# Altium project Monitor.PrjPCB
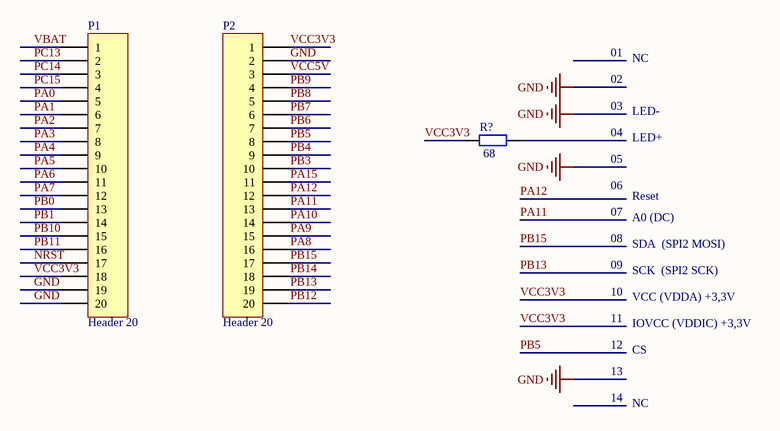
[diagram p0: Monitor_1.SchDoc]
1 sheet, 3 parts. Net scope: global (net labels, ports and power ports of the same name join across sheets).

## Sheet Monitor_1.SchDoc: Debug Monitor
size A4; Author: Vitaly Lev; DrawnBy: Vitaly Lev; Organization: Vitaly Lev; Address1: vitaly.lev@gmail.com; DocumentNumber: 1; Revision: 1.0; SheetNumber: 1; SheetTotal: 2

### Parts
P1  Header 20  [HDR1X20]
P2  Header 20  [HDR1X20]
R?  value 68  [AXIAL-0.4]  (hidden comment: Res2)

### Nets
GND: P1.19 P1.20 P2.2
NRST: P1.17
PA0: P1.5
PA1: P1.6
PA2: P1.7
PA3: P1.8
PA4: P1.9
PA5: P1.10
PA6: P1.11
PA7: P1.12
PA8: P2.16
PA9: P2.15
PA10: P2.14
PA11: P2.13
PA12: P2.12
PA15: P2.11
PB0: P1.13
PB1: P1.14
PB3: P2.10
PB4: P2.9
PB5: P2.8
PB6: P2.7
PB7: P2.6
PB8: P2.5
PB9: P2.4
PB10: P1.15
PB11: P1.16
PB12: P2.20
PB13: P2.19
PB14: P2.18
PB15: P2.17
PC13: P1.2
PC14: P1.3
PC15: P1.4
VBAT: P1.1
VCC3V3: P1.18 P2.1 R?.1
VCC5V: P2.3

Not connected (* = marked no-connect by the designer): R? 2

### Notes on the sheet
- 01
- NC
- 02
- 03
- LED-
- 04
- 05
- 06
- LED+
- 07
- 08
- Reset
- A0 (DC)
- SDA  (SPI2 MOSI)
- 09
- 10
- 11
- SCK  (SPI2 SCK)
- VCC (VDDA) +3,3V
- IOVCC (VDDIC) +3,3V
- 12
- 13
- CS
- 14
- Title
- Size:
- Date:
- A4
- Number:
- Time:
- Revision:
- Sheet
- of
- File:

### Library data of the parts
P1 P2 = Header 20: Header, 20-Pin; LatestRevisionDate: 17-Jul-2002; LatestRevisionNote: Re-released for DXP Platform.; Publisher: Altium Limited
R? = Res2: Resistor; Published: 8-Jun-2000; LatestRevisionDate: 17-Jul-2002; LatestRevisionNote: Re-released for DXP Platform.; PackageReference: AXIAL-0.4; Publisher: Altium Limited; PackageDescription: Axial Device, Thru-Hole; 2 Leads; 0.4 in Pin Spacing